# Altium project Triumvi_v9_sensing.PrjPcb
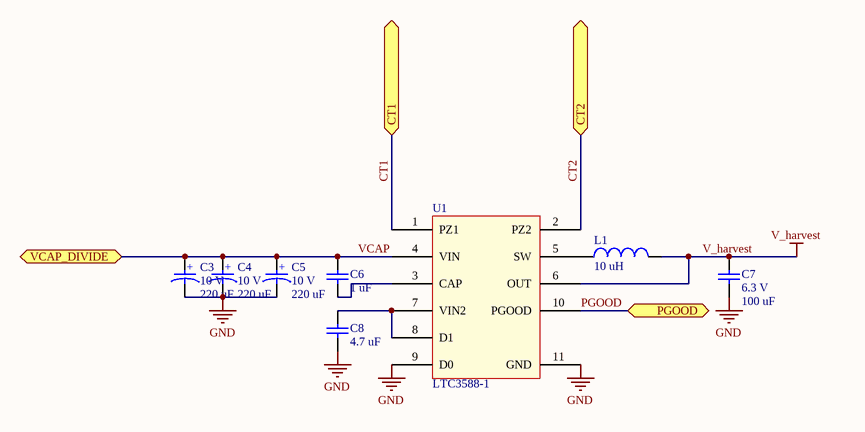
[diagram p0: Energy_harvesting.SchDoc]
3 sheets, 52 parts. Net scope: flat (ports and power ports of the same name join across sheets).
Board files: triumvi_v9.1_sensing.PcbDoc, sensing_batteryPack_panel.PcbDoc
Sheets:
  Energy_harvesting.SchDoc
  IV_sensing.SchDoc
  CT_switching.SchDoc

## Sheet Energy_harvesting.SchDoc: Triumvi - Sensing - Energy Harvesting
size Letter; Author: Ye-Sheng Kuo; Revision: 9; SheetNumber: 2; SheetTotal: 6

### Parts
C3  value 220 uF  voltage rated: 10 V  [2312]  (hidden comment: Tantalum capacitor)
C4  value 220 uF  voltage rated: 10 V  [2312]  (hidden comment: Tantalum capacitor)
C5  value 220 uF  voltage rated: 10 V  [2312]  (hidden comment: Tantalum capacitor)
C6  value 1 uF  [0402]  (hidden comment: Ceramic capacitor)
C7  value 100 uF  voltage rated: 6.3 V  [1206]  (hidden comment: Ceramic capacitor)
C8  value 4.7 uF  [0603]  (hidden comment: Ceramic capacitor)
L1  value 10 uH  [CDRH2D18]  (hidden comment: Chip inductor)
U1  LTC3588-1  [QFN-10]

### Ports
CT1, CT2, PGOOD, VCAP_DIVIDE

### Nets
GND: C3.2 C4.2 C5.2 C7.2 C8.2 U1.9(D0) U1.11(GND)
V_harvest: C7.1 L1.1 U1.6(OUT)
CT1: U1.1(PZ1) ; port CT1
CT2: U1.2(PZ2) ; port CT2
PGOOD: U1.10(PGOOD) ; port PGOOD
VCAP: C3.1 C4.1 C5.1 C6.1 U1.4(VIN) ; port VCAP_DIVIDE
NetC6_2: C6.2 U1.3(CAP)
NetC8_1: C8.1 U1.7(VIN2) U1.8(D1)
NetL1_2: L1.2 U1.5(SW)

### Notes on the sheet
- Title
- Date:
- Author:
- Revision:
- Sheet
- of
- University of Michigan
- File:
- (in symbol C_220u_10V_2312_tantalum) +

### Library data of the parts
C3-C5 = C_220u_10V_2312_tantalum: Tantalum capacitor, 220 uF, 10 V, 2312 package; Manufacture: AVX; tolerance: 10%; package: 1206; Supplier 1: Digi-Key; Supplier Part Number 1: 478-4774-1-ND
C6 = C_1u_16V_0402_ceramic: Ceramic capacitor, 1 uF, 16V, 0402 package; Manufacture: TDK; tolerance: 10%; Temperature rating: X5R; voltage rated: 16 V; package: 0402; Supplier 1: Digi-Key; Supplier Part Number 1: 445-4978-1-ND
C7 = C_100u_6.3V_1206_ceramic: Ceramic capacitor, 100 uF, 6.3 V, 1206 package; Manufacture: Murata; tolerance: 20%; package: 1206; Supplier 1: Digi-Key; Supplier Part Number 1: 490-7217-1-ND
C8 = C_4.7u_10V_0603_ceramic: Ceramic capacitor, 4.7u, 10V, 0603 package; Manufacture: TDK; tolerance: 20%; Temp rating: X5R; package: 0603; voltage rated: 10 V; Supplier 1: Digi-Key; Supplier Part Number 1: 445-7482-1-ND
L1 = L_10uH_1A_180m: Chip inductor, 10 uH,  1A, 180 mOhm; tolerance: 30%; Supplier 1: Digi-Key; Supplier Part Number 1: 308-1959-1-ND
U1 = LTC3588-1: Piezoelectric Energy   Harvesting Power Supply; Supplier 1: Digi-Key; Supplier Part Number 1: LTC3588EMSE-1#PBF-ND; Supplier 2: Digi-Key; Supplier Part Number 2: LTC3588EDD-1#PBF-ND

## Sheet IV_sensing.SchDoc: Triumvi - Sensing - IV Sensing
size Letter; Author: Ye-Sheng Kuo; Revision: 9; SheetNumber: 3; SheetTotal: 6
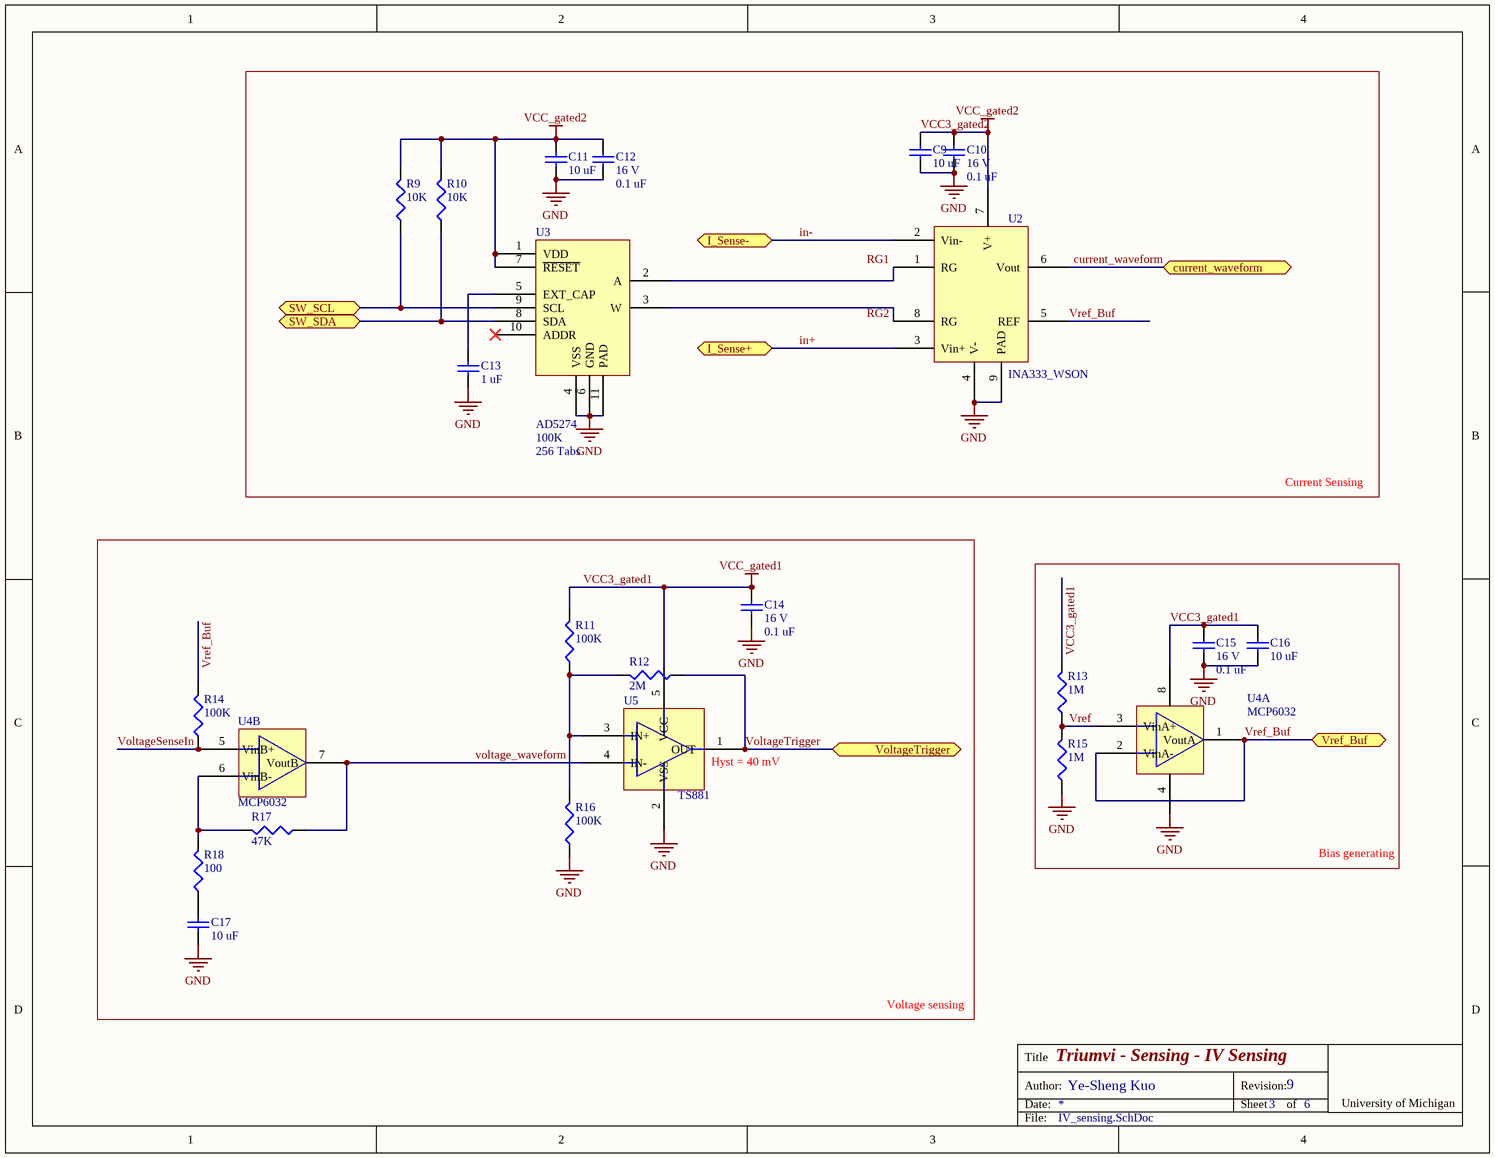
[diagram p1: IV_sensing.SchDoc]

### Parts
C9  value 10 uF  [0603]  (hidden comment: Ceramic capacitor)
C10  value 0.1 uF  voltage rated: 16 V  [0402]  (hidden comment: Ceramic capacitor)
C11  value 10 uF  [0603]  (hidden comment: Ceramic capacitor)
C12  value 0.1 uF  voltage rated: 16 V  [0402]  (hidden comment: Ceramic capacitor)
C13  value 1 uF  [0402]  (hidden comment: Ceramic capacitor)
C14  value 0.1 uF  voltage rated: 16 V  [0402]  (hidden comment: Ceramic capacitor)
C15  value 0.1 uF  voltage rated: 16 V  [0402]  (hidden comment: Ceramic capacitor)
C16  value 10 uF  [0603]  (hidden comment: Ceramic capacitor)
C17  value 10 uF  [0603]  (hidden comment: Ceramic capacitor)
R9  value 10K  [0402]  (hidden comment: Chip resistor)
R10  value 10K  [0402]  (hidden comment: Chip resistor)
R11  value 100K  [0402]  (hidden comment: Chip resistor)
R12  value 2M  [0402]  (hidden comment: Chip resistor)
R13  value 1M  [0402]  (hidden comment: Chip resistor)
R14  value 100K  [0402]  (hidden comment: Chip resistor)
R15  value 1M  [0402]  (hidden comment: Chip resistor)
R16  value 100K  [0402]  (hidden comment: Chip resistor)
R17  value 47K  [0402]  (hidden comment: Chip resistor)
R18  value 100  [0402]  (hidden comment: Chip resistor)
U2  INA333_WSON  [WSON-8]
U3  AD5274  value 100K  [LFCSP_WD]
U4  MCP6032  [MSOP-8]  (parts A,B of 2)
U5  TS881  [SC70-5]

### Blocks framed on the sheet
Current Sensing: C9-C13 R9 R10 U2 U3
Bias generating: C15 C16 R13 R15 U4

### Ports
current_waveform, I_Sense+, I_Sense-, SW_SCL, SW_SDA, VoltageTrigger, Vref_Buf

### Nets
GND: C9.2 C10.2 C11.2 C12.2 C13.2 C14.2 C15.2 C16.2 C17.2 R15.2 R16.2 U2.4(V-) U2.9(PAD) U3.4(VSS) U3.6(GND) U3.11(PAD) U4.4(VSS) U5.2(VSS)
VCC3_gated1: C14.1 C15.1 C16.1 R11.1 R13.1 U4.8(VDD) U5.5(VCC)  [also labelled VCC_gated1]
VCC3_gated2: C9.1 C10.1 C11.1 C12.1 R9.1 R10.1 U2.7(V+) U3.1(VDD) U3.7(~{RESET})  [also labelled VCC_gated2]
current_waveform: U2.6(Vout) ; port current_waveform
in+: U2.3(Vin+) ; port I_Sense+
in-: U2.2(Vin-) ; port I_Sense-
voltage_waveform: R17.2 U4.7(VoutB) U5.4(IN-)
VoltageSenseIn: R14.2 U4.5(VinB+)
VoltageTrigger: R12.2 U5.1(OUT) ; port VoltageTrigger
Vref: R13.2 R15.1 U4.3(VinA+)
Vref_Buf: R14.1 U2.5(REF) U4.1(VoutA) U4.2(VinA-) ; port Vref_Buf
NetC13_1: C13.1 U3.5(EXT_CAP)
NetC17_1: C17.1 R18.2
NetR9_2: R9.2 U3.9(SCL) ; port SW_SCL
NetR10_2: R10.2 U3.8(SDA) ; port SW_SDA
NetR11_2: R11.2 R12.1 R16.1 U5.3(IN+)
NetR17_1: R17.1 R18.1 U4.6(VinB-)
NetU2_1: U2.1(RG) U3.2(A)
NetU2_8: U2.8(RG) U3.3(W)

Not connected (* = marked no-connect by the designer): U3 10(ADDR)*

### Notes on the sheet
- (near U5) Hyst = 40 mV
- Voltage sensing
- Labels drawn without touching a wire or pin: RG1, RG2
- Title
- Date:
- Author:
- Revision:
- Sheet
- of
- University of Michigan
- File:
- (in symbol AD5274) 256 Tabs

### Library data of the parts
C9 C11 C16 C17 = C_10u_6.3V_0603_ceramic: Ceramic capacitor, 10 uF, 0603 package; Manufacture: TDK; voltage rated: 6.3V; tolerance: 20%; package: 0603; Supplier 1: Digi-Key; Supplier Part Number 1: 445-4112-1-ND
C10 C12 C14 C15 = C_0.1u_16V_0402_ceramic: Ceramic capacitor, 0.1u, 16 V, 0402 package; Manufacture: Murata; tolerance: 10%; Temperature Coef: X7R; package: 0402; Supplier 1: Digi-Key; Supplier Part Number 1: 490-3261-1-ND
C13 = C_1u_16V_0402_ceramic: as C6 on sheet Energy_harvesting; voltage rated: 16 V; package: 0402; Supplier 1: Digi-Key; Supplier Part Number 1: 445-4978-1-ND
R9 R10 = R_10K_0402: Chip resistor, 10K, 0402 package; tolerance: 1%; power: 1/16 W; Supplier 1: Digi-Key; Supplier Part Number 1: 541-10.0KLCT-ND; package: 0402
R11 R14 R16 = R_100K_0402: Chip resistor, 100K, 0402 package; tolerance: 1%; power: 1/16 W; Supplier 1: Digi-Key; Supplier Part Number 1: 541-100KLCT-ND; package: 0402
R12 = R_2M_0402: Chip resistor, 2M, 0402 package; tolerance: 1%; power: 1/16 W; package: 0402; Supplier 1: Digi-Key; Supplier Part Number 1: 541-2.00MLCT-ND
R13 R15 = R_1M_0402: Chip resistor, 1M, 0402 package; tolerance: 1%; power: 1/16 W; Supplier 1: Digi-Key; Supplier Part Number 1: 541-1.00MLCT-ND; package: 0402
R17 = R_47K_0402: Chip resistor, 47K, 0402 package; tolerance: 1%; power: 1/16 W; package: 0402; Supplier 1: Digi-Key; Supplier Part Number 1: 541-47.0KLCT-ND
R18 = R_100_0402: Chip resistor, 100, 0402 package; tolerance: 1%; power: 1/16 W; package: 0402; Supplier 1: Digi-Key; Supplier Part Number 1: 541-100LCT-ND
U2 = INA333_WSON: Micro-Power (50µA), Zerø-Drift, Rail-to-Rail Out  Instrumentation Amplifier; Supplier 1: Digi-Key; Supplier Part Number 1: 296-41266-1-ND
U3 = AD5274: 1024-/256-Position, 1% Resistor Tolerance Error, I2C Interface and 50-TP Memory Digital Rheostat; Supplier 1: Digi-Key; Supplier Part Number 1: AD5274BCPZ-100-RL7CT-ND
U4 = MCP6032: 0.9 µA, High Precision Op Amps; Supplier 1: Digi-Key; Supplier Part Number 1: MCP6032-E/MS-ND
U5 = TS881: Rail-to-rail 0.9 V nanopower comparator; Supplier 1: Digi-Key; Supplier Part Number 1: 497-13217-1-ND

## Sheet CT_switching.SchDoc: Triumvi - Sensing - CT Switching
size Letter; Author: Ye-Sheng Kuo; Revision: 9; SheetNumber: 5; SheetTotal: 6
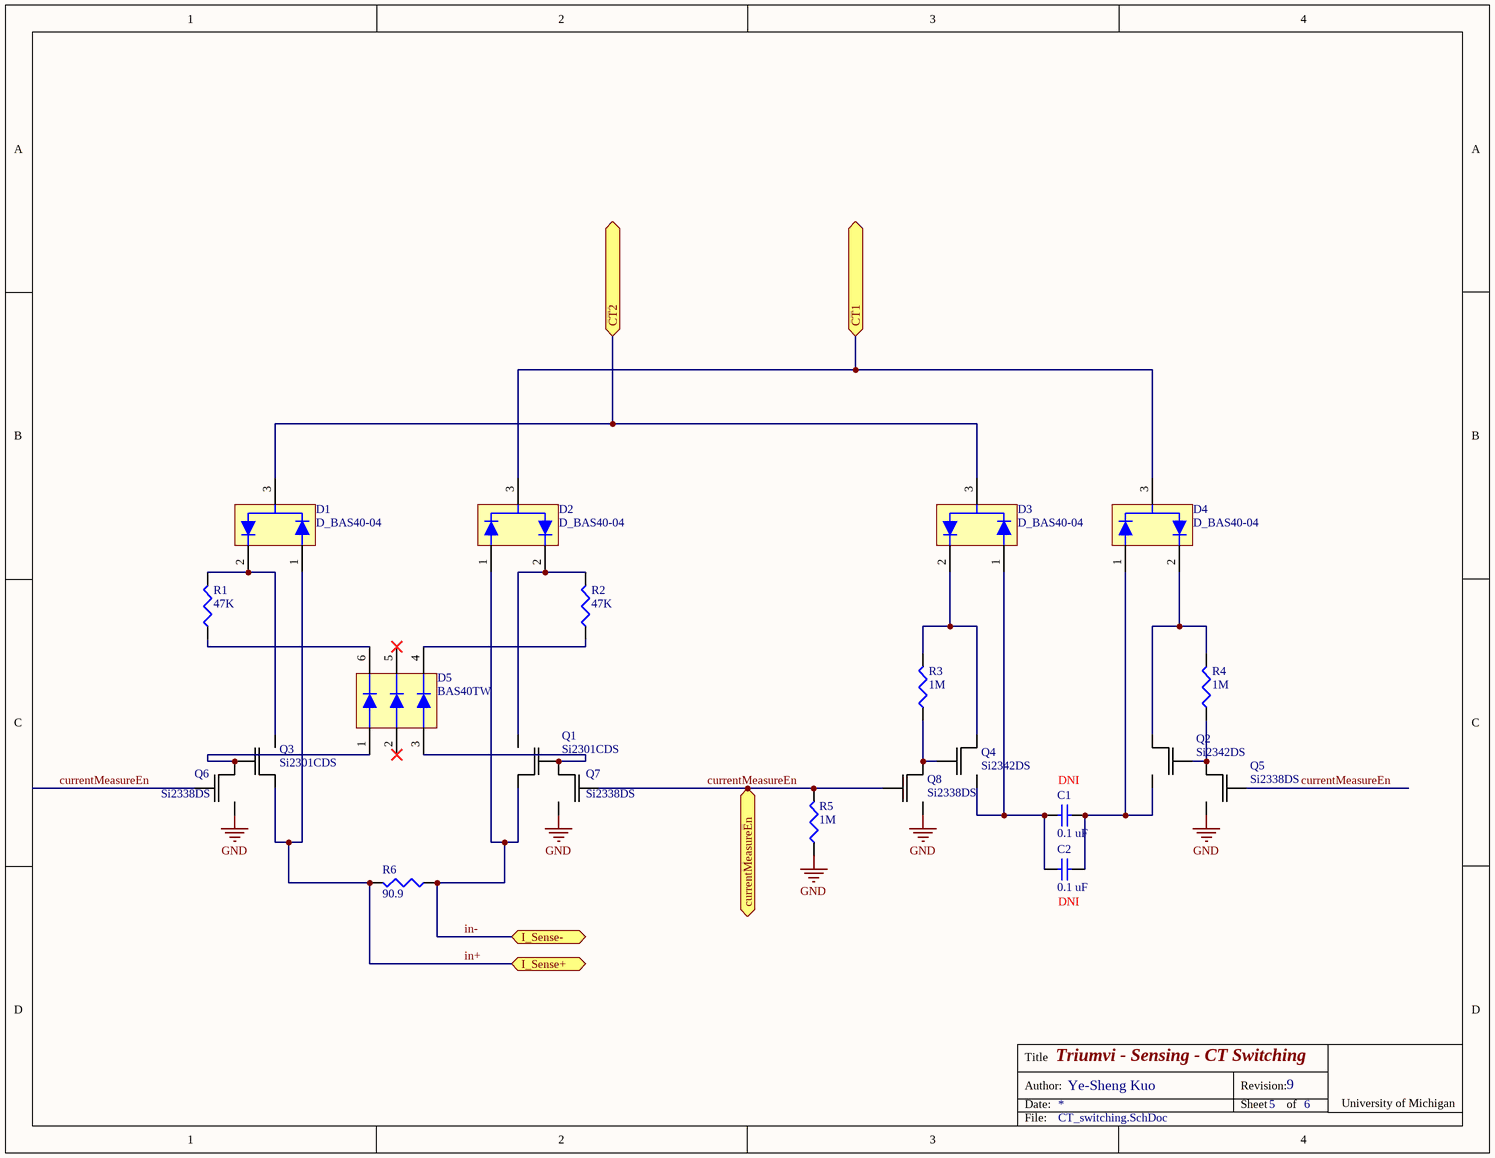
[diagram p2: CT_switching.SchDoc]

### Parts
C1  value 0.1 uF  [0603]  (hidden comment: Ceramic capacitor)
C2  value 0.1 uF  [0603]  (hidden comment: Ceramic capacitor)
D1  D_BAS40-04  [SOT23-3]
D2  D_BAS40-04  [SOT23-3]
D3  D_BAS40-04  [SOT23-3]
D4  D_BAS40-04  [SOT23-3]
D5  BAS40TW  [SOT-363]
Q1  Si2301CDS  [SOT23-3]
Q2  Si2342DS  [SOT23-3]
Q3  Si2301CDS  [SOT23-3]
Q4  Si2342DS  [SOT23-3]
Q5  Si2338DS  [SOT23-3]
Q6  Si2338DS  [SOT23-3]
Q7  Si2338DS  [SOT23-3]
Q8  Si2338DS  [SOT23-3]
R1  value 47K  [0402]  (hidden comment: Chip resistor)
R2  value 47K  [0402]  (hidden comment: Chip resistor)
R3  value 1M  [0402]  (hidden comment: Chip resistor)
R4  value 1M  [0402]  (hidden comment: Chip resistor)
R5  value 1M  [0402]  (hidden comment: Chip resistor)
R6  value 90.9  [0603]  (hidden comment: Chip resistor)

### Ports
CT1, CT2, currentMeasureEn, I_Sense+, I_Sense-

### Nets
GND: Q5.2(S) Q6.2(S) Q7.2(S) Q8.2(S) R5.2
CT1: D2.3 D4.3 ; port CT1
CT2: D1.3 D3.3 ; port CT2
currentMeasureEn: Q5.1(G) Q6.1(G) Q7.1(G) Q8.1(G) R5.1 ; port currentMeasureEn
in+: D1.1 Q3.3(D) R6.1 ; port I_Sense+
in-: D2.1 Q1.3(D) R6.2 ; port I_Sense-
NetC1_1: C1.1 C2.1 D3.1 Q4.2(S)
NetC1_2: C1.2 C2.2 D4.1 Q2.2(S)
NetD1_2: D1.2 Q3.2(S) R1.1
NetD2_2: D2.2 Q1.2(S) R2.1
NetD3_2: D3.2 Q4.3(D) R3.1
NetD4_2: D4.2 Q2.3(D) R4.1
NetD5_1: D5.1 Q3.1(G) Q6.3(D)
NetD5_3: D5.3 Q1.1(G) Q7.3(D)
NetD5_4: D5.4 R2.2
NetD5_6: D5.6 R1.2
NetQ2_1: Q2.1(G) Q5.3(D) R4.2
NetQ4_1: Q4.1(G) Q8.3(D) R3.2

Not connected (* = marked no-connect by the designer): D5 2* 5*

### Notes on the sheet
- (near C1) DNI
- (near C2) DNI
- Title
- Date:
- Author:
- Revision:
- Sheet
- of
- University of Michigan
- File:

### Library data of the parts
C1 C2 = C_0.1u_25V_0603_ceramic: Ceramic capacitor, 0.1 uF, 0603 package; Manufacture: TDK; voltage rated: 25V; tolerance: 10%; package: 0603; Supplier 1: Digi-Key; Supplier Part Number 1: 445-1316-1-ND
D1-D4 = D_BAS40-04: SURFACE MOUNT SCHOTTKY BARRIER DIODE; Supplier 1: Digi-Key; Supplier Part Number 1: BAS40-04FDICT-ND
D5 = D_BAS40TW: SURFACE MOUNT SCHOTTKY BARRIER DIODE ARRAYS; Supplier 1: Digi-Key; Supplier Part Number 1: BAS40TW-FDICT-ND
Q1 Q3 = Si2301CDS: P-Channel 20 V (D-S) MOSFET; Supplier 1: Digi-Key; Supplier Part Number 1: SI2301CDS-T1-E3CT-ND
Q2 Q4 = Si2342DS: N-Channel 8 V (D-S) MOSFET; Supplier 1: Digi-Key; Supplier Part Number 1: SI2342DS-T1-GE3CT-ND
Q5-Q8 = Si2338DS: N-Channel 30 V (D-S) MOSFET; Supplier 1: Digi-Key; Supplier Part Number 1: SI2338DS-T1-GE3CT-ND
R1 R2 = R_47K_0402: as R17 on sheet IV_sensing; package: 0402; Supplier 1: Digi-Key; Supplier Part Number 1: 541-47.0KLCT-ND
R3-R5 = R_1M_0402: as R13 on sheet IV_sensing; Supplier 1: Digi-Key; Supplier Part Number 1: 541-1.00MLCT-ND; package: 0402
R6 = R_90.9_0603: Chip resistor, 90.9, 0603 package; tolerance: 0.1%; power: 1/10 W; package: 0603; Supplier 1: Digi-Key; Supplier Part Number 1: P90.9DBCT-ND

## Nets that join several sheets
GND: Energy_harvesting (7 pins), IV_sensing (18 pins), CT_switching (5 pins)
CT1: Energy_harvesting (U1.1), CT_switching (D2.3 D4.3)
CT2: Energy_harvesting (U1.2), CT_switching (D1.3 D3.3)
in+: IV_sensing (U2.3), CT_switching (D1.1 Q3.3 R6.1)
in-: IV_sensing (U2.2), CT_switching (D2.1 Q1.3 R6.2)